# EAGLE design board (EAGLE 9.6.2)
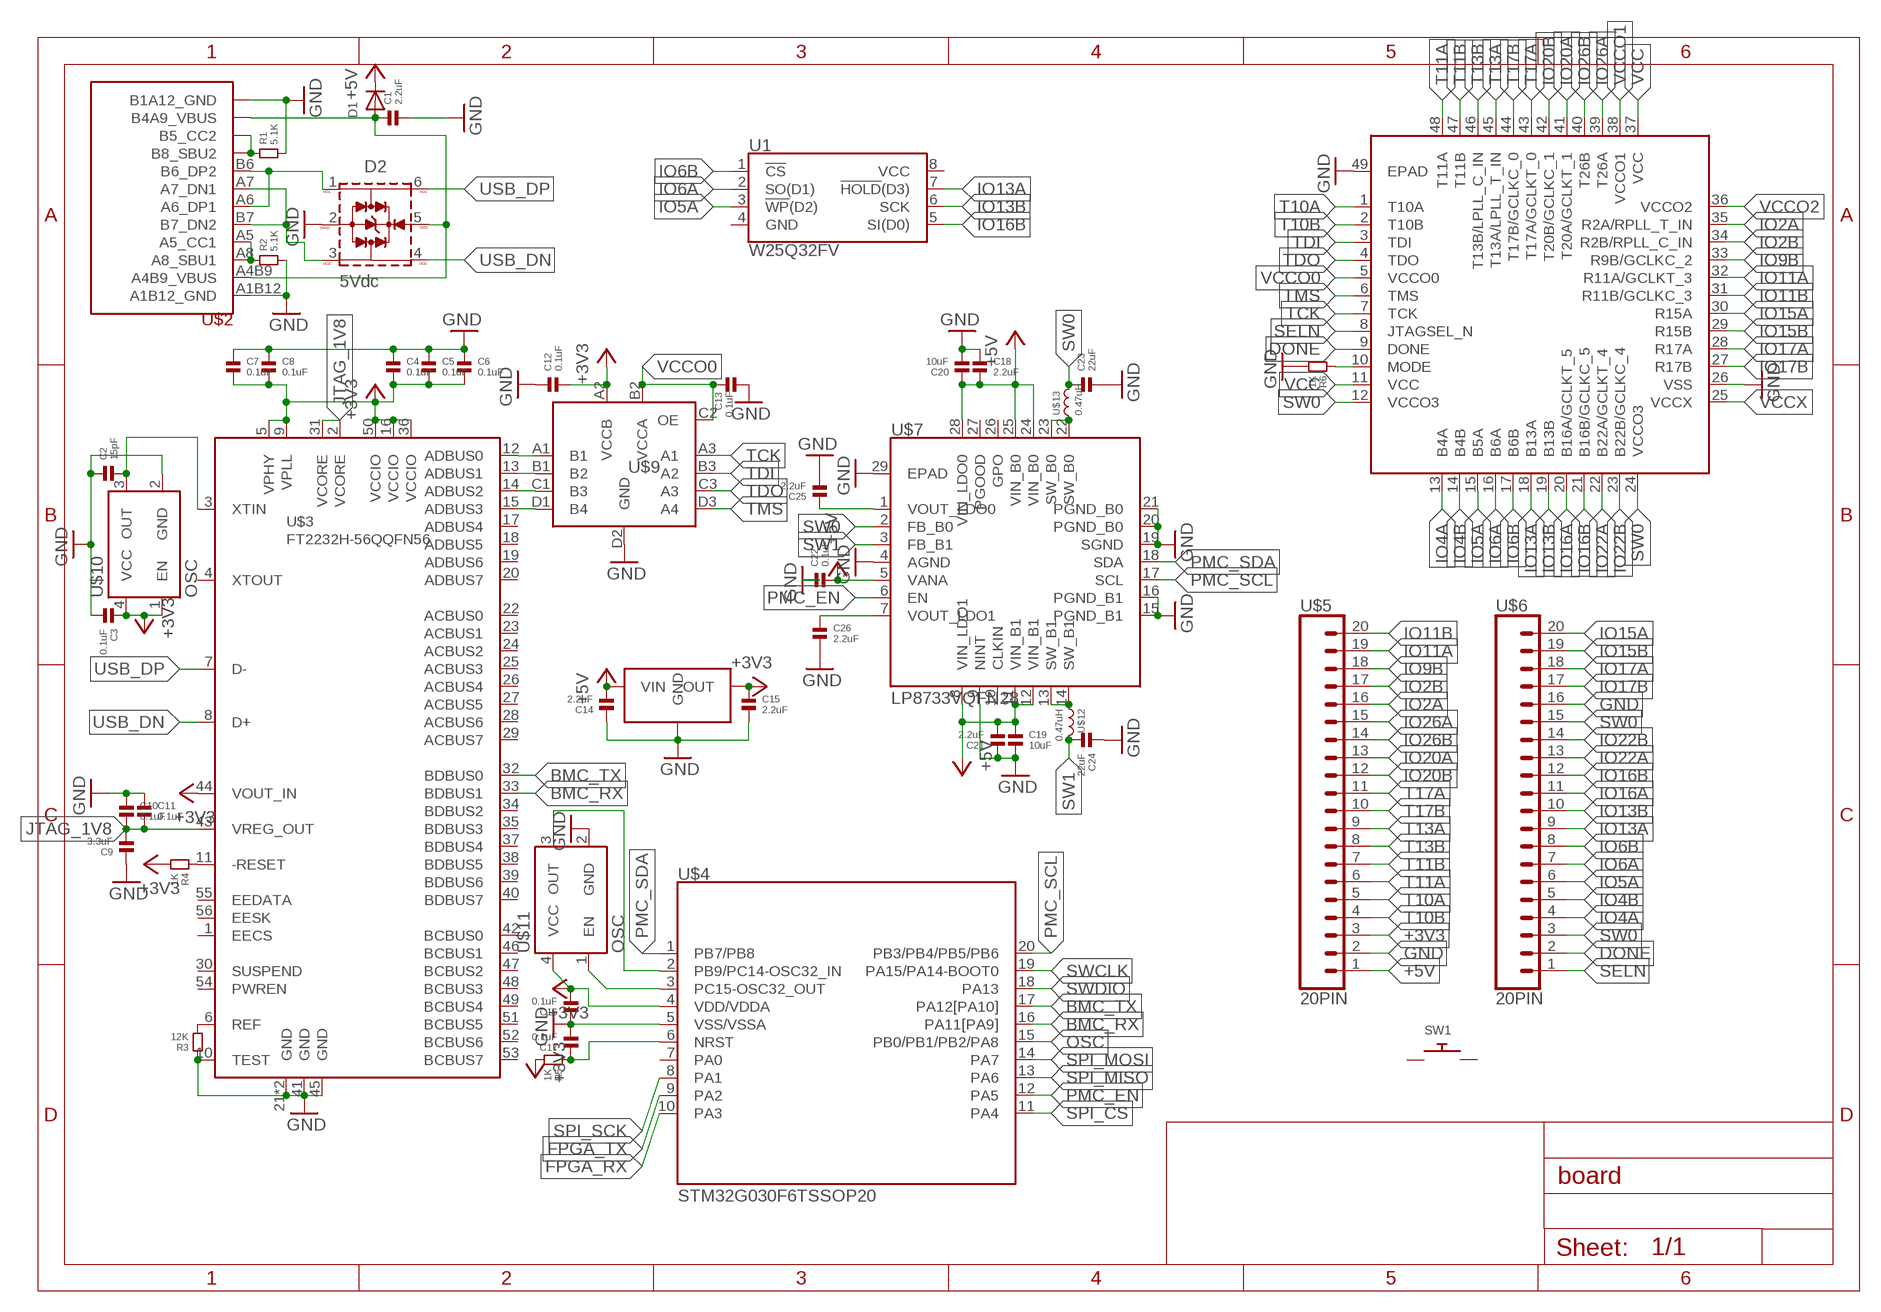
[diagram p0: schematic, sheet 1]

## Parts
C1  2.2uF  CAPACITOR0603  [0603_CAP]
C2  15pF  CAPACITOR  [0402_CAP]
C3  0.1uF  CAPACITOR  [0402_CAP]
C4  0.1uF  CAPACITOR  [0402_CAP]
C5  0.1uF  CAPACITOR  [0402_CAP]
C6  0.1uF  CAPACITOR  [0402_CAP]
C7  0.1uF  CAPACITOR  [0402_CAP]
C8  0.1uF  CAPACITOR  [0402_CAP]
C9  3.3uF  CAPACITOR0603  [0603_CAP]
C10  0.1uF  CAPACITOR  [0402_CAP]
C11  0.1uF  CAPACITOR  [0402_CAP]
C12  0.1uF  CAPACITOR  [0402_CAP]
C13  0.1uF  CAPACITOR  [0402_CAP]
C14  2.2uF  CAPACITOR0603  [0603_CAP]
C15  2.2uF  CAPACITOR0603  [0603_CAP]
C16  0.1uF  CAPACITOR  [0402_CAP]
C17  0.1uF  CAPACITOR  [0402_CAP]
C18  2.2uF  CAPACITOR0603  [0603_CAP]
C19  10uF  CAPACITOR0805  [0805_CAP]
C20  10uF  CAPACITOR0805  [0805_CAP]
C21  2.2uF  CAPACITOR0603  [0603_CAP]
C22  0.1uF  CAPACITOR  [0402_CAP]
C23  22uF  CAPACITOR0805  [0805_CAP]
C24  22uF  CAPACITOR0805  [0805_CAP]
C25  2.2uF  CAPACITOR0603  [0603_CAP]
C26  2.2uF  CAPACITOR0603  [0603_CAP]
D1  DIODESOD-323F  [SOD-323F]
D2  5Vdc  WE-TVS-HS_SOT23-6L_82400102  [WE-TVS_SOT23-6L]
R1  5.1K  RESISTOR.0402  [0402]
R2  5.1K  RESISTOR.0402  [0402]
R3  12K  RESISTOR.0402  [0402]
R4  1K  RESISTOR.0402  [0402]
R5  1K  RESISTOR.0402  [0402]
R6  1K  RESISTOR.0402  [0402]
SW1  SWITCH_PUSHBUTTONC&K_KSS  [BTN_CK_KSS]
U1  W25Q32FV  GD25LQ128DVIG  [SOIC-8]
U$1  GW1NSR-4CQN48P  [QFN40P600X600X80-49T420N]
U$2  TYPEC  [TYPE-C-31-M-12]
U$3  FT2232H-56QQFN56  [QFN50P800X800X90-57T595N]
U$4  STM32G030F6TSSOP20  [SOP65P640X120-20N]
U$5  20PIN  120PIN  [HDRV20W64P254_1X20_5080X254X838B]
U$6  20PIN  120PIN  [HDRV20W64P254_1X20_5080X254X838B]
U$7  LP8733VQFN28  [QFN50P500X500X100-29T340N]
U$8  XC6206  [SOT95P280X125-3]
U$9  TXS0104EYZTR  [BGA12C50P3X4_186X136X62N]
U$10  OSC  [OSCCC200X160X85N]
U$11  OSC  [OSCCC200X160X85N]
U$12  0.47uH  SPH252012H1R5MT  [INDM2621X120]
U$13  0.47uH  SPH252012H1R5MT  [INDM2621X120]

## Nets
+3V3: C3.1 C4.2 C5.2 C6.2 C7.2 C8.2 C12.2 C15.1 C16.2 R4.2 R5.2 U$3.5(VPHY) U$3.9(VPLL) U$3.16(VCCIO) U$3.36(VCCIO) U$3.44(VOUT_IN) U$3.50(VCCIO) U$4.4(VDD/VDDA) U$5.3 U$8.2(OUT) U$9.A2(VCCB) U$10.1(EN) U$10.4(VCC) U$11.4(VCC)
+5V: C14.2 C18.2 C19.1 C20.1 C21.2 C22.2 D1.C U$5.1 U$7.5(VANA) U$7.8(VIN_LDO1) U$7.11(VIN_B1) U$7.12(VIN_B1) U$7.24(VIN_B0) U$7.25(VIN_B0) U$7.28(VIN_LDO0) U$8.3(VIN)
BMC_RX: U$3.33(BDBUS1) U$4.16(PA11[PA9])
BMC_TX: U$3.32(BDBUS0) U$4.17(PA12[PA10])
DONE: U$1.9(DONE) U$6.2
FB0: U$7.22(SW_B0) U$7.23(SW_B0) U$13.1
FB1: U$7.13(SW_B1) U$7.14(SW_B1) U$12.1
FPGA_RX: U$4.10(PA3)
FPGA_TX: U$4.9(PA2)
GND: C1.2 C2.1 C3.2 C4.1 C5.1 C6.1 C7.1 C8.1 C9.1 C10.1 C11.1 C12.1 C13.2 C14.1 C15.2 C16.1 C17.2 C18.1 C19.2 C20.2 C21.1 C22.1 C23.2 C24.1 C25.2 C26.2 D2.2(GND) R1.2 R2.2 R3.1 R6.2 U$1.26(VSS) U$1.49(EPAD) U$2.A1B12(A1B12_GND) U$2.B1A12(B1A12_GND) U$3.10(TEST) U$3.21(GND) U$3.41(GND) U$3.45(GND) U$3.57(GND) U$4.5(VSS/VSSA) U$5.2 U$6.16 U$7.4(AGND) U$7.9(NINT) U$7.15(PGND_B1) U$7.16(PGND_B1) U$7.19(SGND) U$7.20(PGND_B0) U$7.21(PGND_B0) U$7.29(EPAD) U$8.1(GND) U$9.D2(GND) U$10.2(GND) U$11.2(GND)
IO2A: U$1.35(R2A/RPLL_T_IN) U$5.16
IO2B: U$1.34(R2B/RPLL_C_IN) U$5.17
IO4A: U$1.13(B4A) U$6.4
IO4B: U$1.14(B4B) U$6.5
IO5A: U1.3(!WP!(D2)) U$1.15(B5A) U$6.6
IO6A: U1.2(SO(D1)) U$1.16(B6A) U$6.7
IO6B: U1.1(!CS!) U$1.17(B6B) U$6.8
IO9B: U$1.33(R9B/GCLKC_2) U$5.18
IO11A: U$1.32(R11A/GCLKT_3) U$5.19
IO11B: U$1.31(R11B/GCLKC_3) U$5.20
IO13A: U1.7(!HOLD!(D3)) U$1.18(B13A) U$6.9
IO13B: U1.6(SCK) U$1.19(B13B) U$6.10
IO15A: U$1.30(R15A) U$6.20
IO15B: U$1.29(R15B) U$6.19
IO16A: U$1.20(B16A/GCLKT_5) U$6.11
IO16B: U1.5(SI(D0)) U$1.21(B16B/GCLKC_5) U$6.12
IO17A: U$1.28(R17A) U$6.18
IO17B: U$1.27(R17B) U$6.17
IO20A: U$1.41(T20A/GCLKT_1) U$5.13
IO20B: U$1.42(T20B/GCLKC_1) U$5.12
IO22A: U$1.22(B22A/GCLKT_4) U$6.13
IO22B: U$1.23(B22B/GCLKC_4) U$6.14
IO26A: U$1.39(T26A) U$5.15
IO26B: U$1.40(T26B) U$5.14
JTAG_1V8: C9.2 C10.2 C11.2 U$3.2(VCORE) U$3.31(VCORE) U$3.43(VREG_OUT)
N$1: C2.2 U$3.3(XTIN) U$10.3(OUT)
N$2: U$3.12(ADBUS0) U$9.A1(B1)
N$3: U$3.13(ADBUS1) U$9.B1(B2)
N$4: U$3.14(ADBUS2) U$9.C1(B3)
N$5: U$3.15(ADBUS3) U$9.D1(B4)
N$6: D2.1(I/O1) U$2.A6(A6_DP1) U$2.B6(B6_DP2)
N$7: D2.3(I/O2) U$2.A7(A7_DN1) U$2.B7(B7_DN2)
N$8: C1.1 D1.A D2.5(VDD) U$2.A4B9(A4B9_VBUS) U$2.B4A9(B4A9_VBUS)
N$9: R2.1 U$2.A5(A5_CC1) U$2.A8(A8_SBU1)
N$10: R1.1 U$2.B5(B5_CC2) U$2.B8(B8_SBU2)
N$12: R3.2 U$3.6(REF)
N$13: R4.1 U$3.11(-RESET)
N$15: C17.1 R5.1 U$4.6(NRST)
N$17: R6.1 U$1.10(MODE)
N$56: C25.1 U$7.1(VOUT_LDO0)
N$60: U$4.2(PB9/PC14-OSC32_IN) U$11.3(OUT)
N$61: U$4.3(PC15-OSC32_OUT) U$11.1(EN)
N$62: C26.1 U$7.7(VOUT_LDO1)
OSC: U$4.15(PB0/PB1/PB2/PA8)
PMC_EN: U$4.12(PA5) U$7.6(EN)
PMC_SCL: U$4.20(PB3/PB4/PB5/PB6) U$7.17(SCL)
PMC_SDA: U$4.1(PB7/PB8) U$7.18(SDA)
SELN: U$1.8(JTAGSEL_N) U$6.1
SPI_CS: U$4.11(PA4)
SPI_MISO: U$4.13(PA6)
SPI_MOSI: U$4.14(PA7)
SPI_SCK: U$4.8(PA1)
SW0: C23.1 U$1.12(VCCO3) U$1.24(VCCO3) U$6.3 U$6.15 U$7.2(FB_B0) U$13.2
SW1: C24.2 U$7.3(FB_B1) U$12.2
SWCLK: U$4.19(PA15/PA14-BOOT0)
SWDIO: U$4.18(PA13)
T10A: U$1.1(T10A) U$5.5
T10B: U$1.2(T10B) U$5.4
T11A: U$1.48(T11A) U$5.6
T11B: U$1.47(T11B) U$5.7
T13A: U$1.45(T13A/LPLL_T_IN) U$5.9
T13B: U$1.46(T13B/LPLL_C_IN) U$5.8
T17A: U$1.43(T17A/GCLKT_0) U$5.11
T17B: U$1.44(T17B/GCLKC_0) U$5.10
TCK: U$1.7(TCK) U$9.A3(A1)
TDI: U$1.3(TDI) U$9.B3(A2)
TDO: U$1.4(TDO) U$9.C3(A3)
TMS: U$1.6(TMS) U$9.D3(A4)
USB_DN: D2.4(I/O4) U$3.8(D+)
USB_DP: D2.6(I/O3) U$3.7(D-)
VCC: U$1.11(VCC) U$1.37(VCC)
VCCO0: C13.1 U$1.5(VCCO0) U$9.B2(VCCA) U$9.C2(OE)
VCCO1: U$1.38(VCCO1)
VCCO2: U$1.36(VCCO2)
VCCX: U$1.25(VCCX)
Unconnected: SW1.P$1 SW1.P$2 U1.4(GND) U1.8(VCC) U$3.1(EECS) U$3.4(XTOUT) U$3.17(ADBUS4) U$3.18(ADBUS5) U$3.19(ADBUS6) U$3.20(ADBUS7) U$3.22(ACBUS0) U$3.23(ACBUS1) U$3.24(ACBUS2) U$3.25(ACBUS3) U$3.26(ACBUS4) U$3.27(ACBUS5) U$3.28(ACBUS6) U$3.29(ACBUS7) U$3.30(SUSPEND) U$3.34(BDBUS2) U$3.35(BDBUS3) U$3.37(BDBUS4) U$3.38(BDBUS5) U$3.39(BDBUS6) U$3.40(BDBUS7) U$3.42(BCBUS0) U$3.46(BCBUS1) U$3.47(BCBUS2) U$3.48(BCBUS3) U$3.49(BCBUS4) U$3.51(BCBUS5) U$3.52(BCBUS6) U$3.53(BCBUS7) U$3.54(PWREN) U$3.55(EEDATA) U$3.56(EESK) U$4.7(PA0) U$7.10(CLKIN) U$7.26(GPO) U$7.27(PGOOD)

## Library data of the parts
C1-C26 = standardparts:CAPACITOR
D1 = adafruit:DIODE: Diode SMADIODE - SMA Surface Mount Package 20V 1A Schottky Diode Digikey: 641-1014-6-ND DO-1N4148 - Through Hole Small Current Diode SOD-123 20V 1 A (.5mV Vf) Schottky Diode - Digikey: MBRX120TPMSCT-ND SOD-323 10V 570mA (.38mV Vf, 3ns) Schottky Diode - Digikey: ZLLS410CT-ND SOD-523 30V 30mA Schottky Diode (RB751S-40TE61) - Digikey: RB751S-40TE61CT-ND SOT23-R/W - SOT23 Package (R = Solder Paste/Reflow Ovens, W = Hand-Soldering) BAT54Film 40V 300mA - Digikey: 497-7162-1-ND
D2 = Wurth_EMC Components_WE-TVS:WE-TVS-HS_SOT23-6L_82400102: WE-TVS TVS Diode – High Speed Series Characteristics Low clamping voltage Sturdy design Very low capacitance Flow Thru Design for a simple layout Rail to Rail protection Epoxy flame resistant UL94-V0 RoHS, REACH and free of halogens Applications Very fast data lines USB 2.0 Ethernet PoE VGA Sim Cards Keypads HS = High Speed <https://katalog.we-online.com/media/images/v2/o14883v209%20Family_WE-TVS_HIGHSPEED.> Details see: https://katalog.we-online.com/en/pbs/WE-TVS-HS Updated by Ella Wu 2019-07-12 2019 (C) Wurth Elektronik; C-CH: 2pF; CHANNELS: 2+1; DATASHEET-URL: https://www.we-online.com/catalog/datasheet/82400102.pdf; IPEAK: 6A; MOUNT: SMT; PART-NUMBER: 82400102; VBR: 6V
R1-R6 = standardparts:RESISTOR
SW1 = adafruit:SWITCH_PUSHBUTTON: Buttons SOFTTOUCHSMD_SJ - Soft touch temporary push button (Super Junk Akihabara) Compatible with SKPMANE010 [Mouser: 688-SKPMAN] C&K_KSS = Digikey: KSS221GLFS
U1 = Kendryte-K210:GD25LQ128D: W25Q32FV 32Mb (4MB) Serial Flash Memory The W25Q32FV support the standard Serial Peripheral Interface (SPI), Dual/Quad I/O SPI as well as 2-clocks instruction cycle Quad Peripheral Interface (QPI). 104MHz, SPI, 8-SOIC-EIAJ Datasheet <http://www.winbond.com/resource-files/w25q32fv%20revh%20091613.pdf> SparkFun Products SparkFun Blynk Board - ESP8266 <https://www.sparkfun.com/products/13794> (WRL-13794); PROD_ID: IC-13229
U$1 = Gowin:GW1NSR-4C
U$2 = Kendryte-K210:TYPEC
U$3 = Gowin:FT2232H-56Q
U$4 = Gowin:STM32G030F6
U$5 U$6 = Gowin:1*20PIN
U$7 = Gowin:LP8733
U$8 = AG1280:XC6206
U$9 = Gowin:TXS0104
U$10 U$11 = Gowin:OSC
U$12 U$13 = Kendryte-K210:SPH252012H1R5MT

## Board
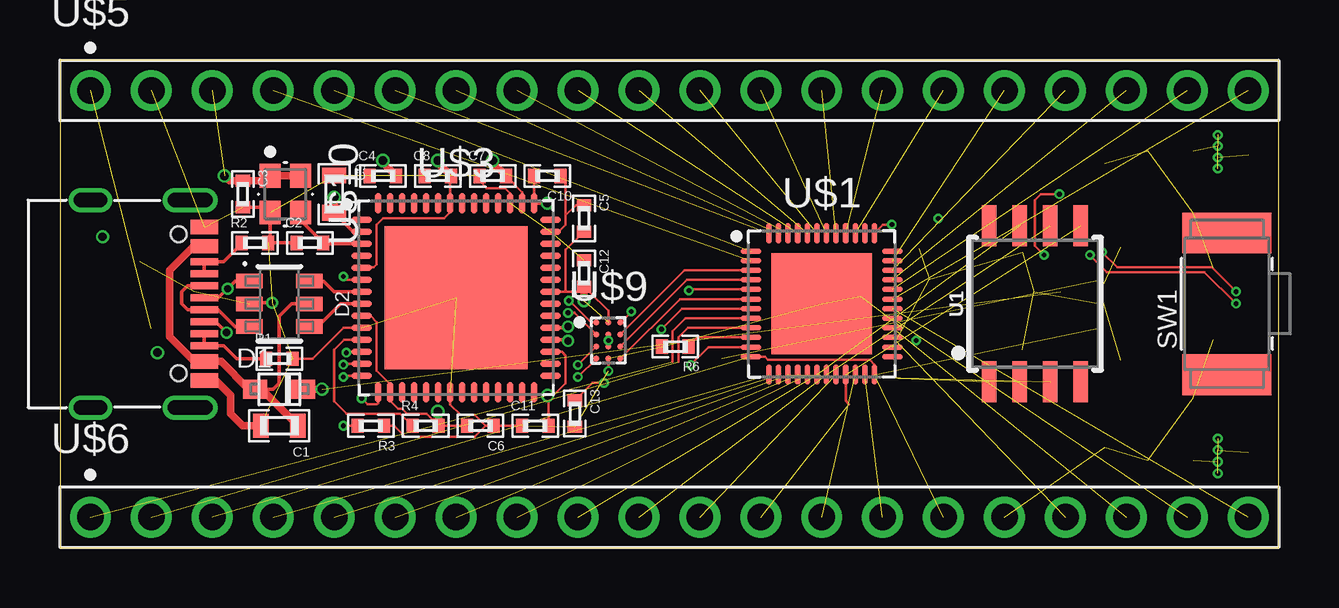
[diagram p1: board, top side]
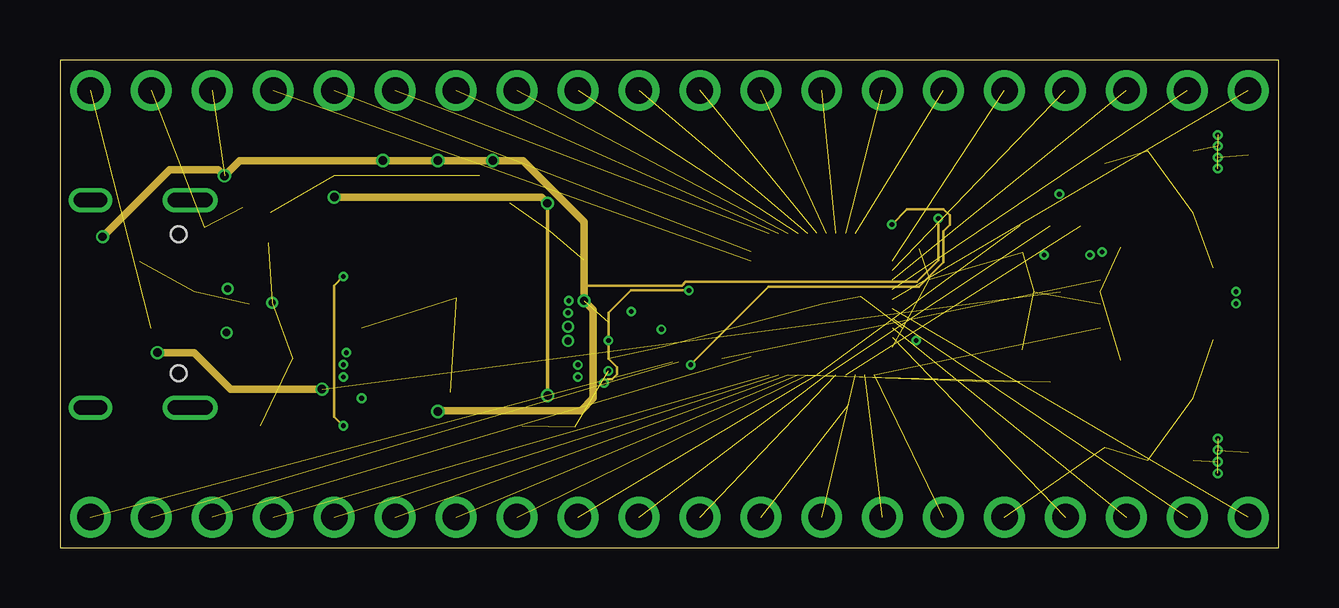
[diagram p2: board, inner layer POWER]
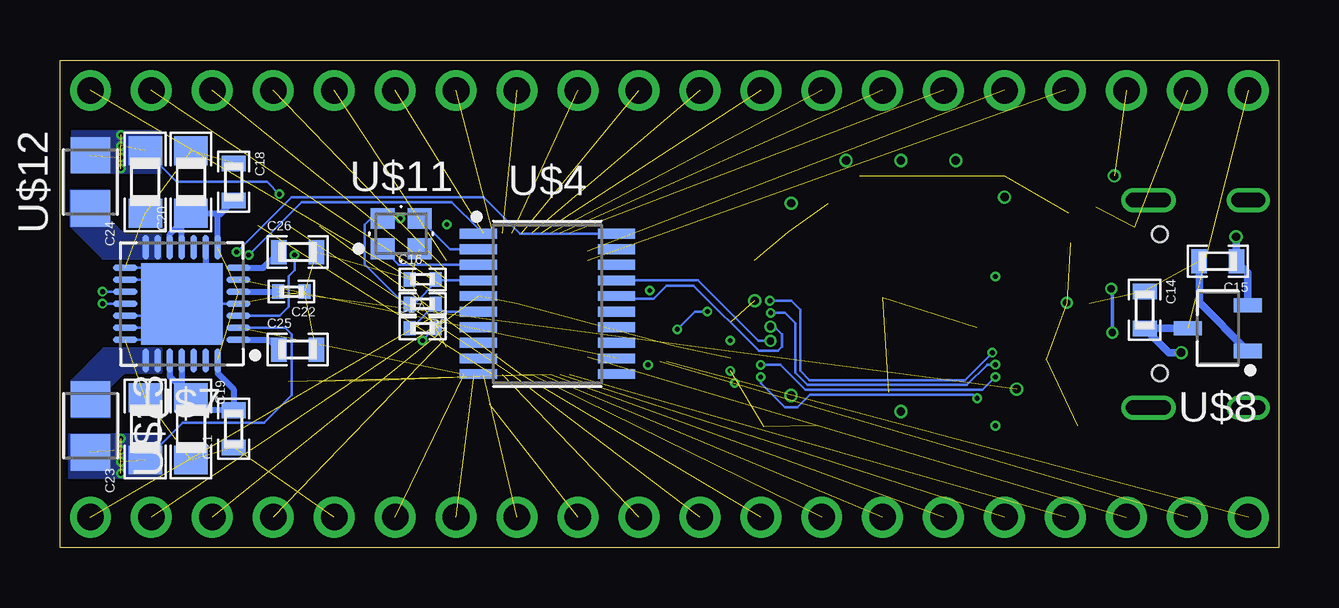
[diagram p3: board, bottom side, seen from below]

Size 50.8 x 20.32 mm. Coordinates in mm from the lower left corner, seen from the top.
Outline: 0,0 50.8,0 50.8,20.32 0,20.32 0,0
Copper layers (1+2*15+16): Top 0.035mm / dielectric 0.2mm / GND 0.0175mm / dielectric 1.065mm / POWER 0.0175mm / dielectric 0.2mm / Bottom 0.035mm
Design rules "default *": minimum track width 4mil, minimum drill 0.2mm, track to track 4mil, track to pad 4mil, pad to pad 4mil, via to via 4mil, smd to smd 4mil, copper to edge 12mil, drill to drill 6mil, minimum pad ring 0.1mm, minimum via ring 0.1mm, stop-mask expansion 4mil, vias tented up to drill 0.5mm, thermal gap 10mil

### Footprints (pad centres in the part's own frame; a part is rotated, then mirrored left to right if it is on the bottom)
0603_CAP = smd 0.65 x 1: 1 -0.775,0; 2 0.775,0
0402_CAP = smd 0.5 x 0.6: 1 -0.55,0; 2 0.55,0
0805_CAP = smd 1.2 x 1.4: 1 -1.3,0; 2 1.3,0
SOD-323F = smd 1 x 0.8: A -1,0; C 1,0
WE-TVS_SOT23-6L = smd 0.6 x 1.1: 1 -0.95,-1.25; 2 0,-1.25; 3 0.95,-1.25; 4 0.95,1.25; 5 0,1.25; 6 -0.95,1.25
0402 = smd 0.5 x 0.6: 1 -0.55,0; 2 0.55,0
BTN_CK_KSS = smd 1.7 x 3.7: P$1 -2.95,0; P$2 2.95,0
SOIC-8 = smd 0.61 x 1.702: 1 -1.905,-3.251; 2 -0.635,-3.251; 3 0.635,-3.251; 4 1.905,-3.251; 5 1.905,3.251; 6 0.635,3.251; 7 -0.635,3.251; 8 -1.905,3.251
QFN40P600X600X80-49T420N = smd 0.838 x 0.22: 1 -2.946,2.2; 2 -2.946,1.8; 3 -2.946,1.4; 4 -2.946,1; 5 -2.946,0.6; 6 -2.946,0.2; 7 -2.946,-0.2; 8 -2.946,-0.6; 9 -2.946,-1; 10 -2.946,-1.4; 11 -2.946,-1.8; 12 -2.946,-2.2; 25 2.946,-2.2; 26 2.946,-1.8; 27 2.946,-1.4; 28 2.946,-1; 29 2.946,-0.6; 30 2.946,-0.2; 31 2.946,0.2; 32 2.946,0.6; 33 2.946,1; 34 2.946,1.4; 35 2.946,1.8; 36 2.946,2.2 | smd 0.22 x 0.838: 13 -2.2,-2.946; 14 -1.8,-2.946; 15 -1.4,-2.946; 16 -1,-2.946; 17 -0.6,-2.946; 18 -0.2,-2.946; 19 0.2,-2.946; 20 0.6,-2.946; 21 1,-2.946; 22 1.4,-2.946; 23 1.8,-2.946; 24 2.2,-2.946; 37 2.2,2.946; 38 1.8,2.946; 39 1.4,2.946; 40 1,2.946; 41 0.6,2.946; 42 0.2,2.946; 43 -0.2,2.946; 44 -0.6,2.946; 45 -1,2.946; 46 -1.4,2.946; 47 -1.8,2.946; 48 -2.2,2.946 | smd 4.2 x 4.2: 49 0,0
TYPE-C-31-M-12 = smd 0.6 x 1.14: A1B12 -3.2,4.75; A4B9 -2.4,4.75; B1A12 3.2,4.75; B4A9 2.4,4.75 | smd 0.3 x 1.14: A5 -1.25,4.75; A6 -0.25,4.75; A7 0.25,4.75; A8 -1.75,4.75; B5 1.75,4.75; B6 0.75,4.75; B7 -0.75,4.75; B8 1.25,4.75 | drill 0.6 pad 1: P$13 -4.32,4.8; P$14 -4.32,4.64; P$15 -4.32,0.4; P$16 -4.32,0.24; P$17 -4.32,4.48; P$18 -4.32,4.32; P$19 -4.32,4.16; P$20 -4.32,4; P$21 -4.32,3.84; P$22 -4.32,3.68; P$23 -4.32,3.52; P$24 4.32,4.8; P$25 4.32,4.64; P$26 4.32,4.48; P$27 4.32,4.32; P$28 4.32,4.16; P$29 4.32,4; P$30 4.32,3.84; P$31 4.32,3.68; P$32 4.32,3.52; P$33 -4.32,0.08; P$34 -4.32,-0.08; P$35 -4.32,-0.24; P$36 -4.32,-0.4; P$37 4.32,0.4; P$38 4.32,0.24; P$39 4.32,0.08; P$40 4.32,-0.08; P$41 4.32,-0.24; P$42 4.32,-0.4 | hole 0.65: -2.89,3.68; 2.89,3.68
QFN50P800X800X90-57T595N = smd 0.86 x 0.27: 1 -3.935,3.25; 2 -3.935,2.75; 3 -3.935,2.25; 4 -3.935,1.75; 5 -3.935,1.25; 6 -3.935,0.75; 7 -3.935,0.25; 8 -3.935,-0.25; 9 -3.935,-0.75; 10 -3.935,-1.25; 11 -3.935,-1.75; 12 -3.935,-2.25; 13 -3.935,-2.75; 14 -3.935,-3.25; 29 3.935,-3.25; 30 3.935,-2.75; 31 3.935,-2.25; 32 3.935,-1.75; 33 3.935,-1.25; 34 3.935,-0.75; 35 3.935,-0.25; 36 3.935,0.25; 37 3.935,0.75; 38 3.935,1.25; 39 3.935,1.75; 40 3.935,2.25; 41 3.935,2.75; 42 3.935,3.25 | smd 0.27 x 0.86: 15 -3.25,-3.935; 16 -2.75,-3.935; 17 -2.25,-3.935; 18 -1.75,-3.935; 19 -1.25,-3.935; 20 -0.75,-3.935; 21 -0.25,-3.935; 22 0.25,-3.935; 23 0.75,-3.935; 24 1.25,-3.935; 25 1.75,-3.935; 26 2.25,-3.935; 27 2.75,-3.935; 28 3.25,-3.935; 43 3.25,3.935; 44 2.75,3.935; 45 2.25,3.935; 46 1.75,3.935; 47 1.25,3.935; 48 0.75,3.935; 49 0.25,3.935; 50 -0.25,3.935; 51 -0.75,3.935; 52 -1.25,3.935; 53 -1.75,3.935; 54 -2.25,3.935; 55 -2.75,3.935; 56 -3.25,3.935 | smd 5.95 x 5.95: 57 0,0
SOP65P640X120-20N = smd 1.559 x 0.407: 1 -2.878,2.925; 2 -2.878,2.275; 3 -2.878,1.625; 4 -2.878,0.975; 5 -2.878,0.325; 6 -2.878,-0.325; 7 -2.878,-0.975; 8 -2.878,-1.625; 9 -2.878,-2.275; 10 -2.878,-2.925; 11 2.878,-2.925; 12 2.878,-2.275; 13 2.878,-1.625; 14 2.878,-0.975; 15 2.878,-0.325; 16 2.878,0.325; 17 2.878,0.975; 18 2.878,1.625; 19 2.878,2.275; 20 2.878,2.925
HDRV20W64P254_1X20_5080X254X838B = drill 1.105 pad 1.705: 1 0,0; 2 2.54,0; 3 5.08,0; 4 7.62,0; 5 10.16,0; 6 12.7,0; 7 15.24,0; 8 17.78,0; 9 20.32,0; 10 22.86,0; 11 25.4,0; 12 27.94,0; 13 30.48,0; 14 33.02,0; 15 35.56,0; 16 38.1,0; 17 40.64,0; 18 43.18,0; 19 45.72,0; 20 48.26,0
QFN50P500X500X100-29T340N = smd 1.01 x 0.27: 1 -2.36,1.5; 2 -2.36,1; 3 -2.36,0.5; 4 -2.36,0; 5 -2.36,-0.5; 6 -2.36,-1; 7 -2.36,-1.5; 15 2.36,-1.5; 16 2.36,-1; 17 2.36,-0.5; 18 2.36,0; 19 2.36,0.5; 20 2.36,1; 21 2.36,1.5 | smd 0.27 x 1.01: 8 -1.5,-2.36; 9 -1,-2.36; 10 -0.5,-2.36; 11 0,-2.36; 12 0.5,-2.36; 13 1,-2.36; 14 1.5,-2.36; 22 1.5,2.36; 23 1,2.36; 24 0.5,2.36; 25 0,2.36; 26 -0.5,2.36; 27 -1,2.36; 28 -1.5,2.36 | smd 3.4 x 3.4: 29 0,0
SOT95P280X125-3 = smd 1.171 x 0.589: 1 -1.25,0.95; 2 -1.25,-0.95; 3 1.25,0
BGA12C50P3X4_186X136X62N = smd 0.25 x 0.25: A1 -0.5,0.75; A2 0,0.75; A3 0.5,0.75; B1 -0.5,0.25; B2 0,0.25; B3 0.5,0.25; C1 -0.5,-0.25; C2 0,-0.25; C3 0.5,-0.25; D1 -0.5,-0.75; D2 0,-0.75; D3 0.5,-0.75
OSCCC200X160X85N = smd 0.998 x 0.868: 1 -0.767,-0.632; 2 0.767,-0.632; 3 0.767,0.632; 4 -0.767,0.632
INDM2621X120 = smd 1.51 x 1.629: 1 -1.11,0; 2 1.11,0

### Placement (x,y rotation side)
C1  9.14,5.08 180 top
C2  10.41,12.7 0 top
C3  7.62,14.73 270 top
C4  13.46,15.49 0 top
C5  21.84,13.72 270 top
C6  17.53,5.08 180 top
C7  18.03,15.49 0 top
C8  15.75,15.49 0 top
C9  11.43,14.73 270 top
C10  20.32,15.49 180 top
C11  19.81,5.08 0 top
C12  21.84,11.43 270 top
C13  21.46,5.59 270 top
C14  5.59,9.91 270 bottom
C15  2.54,11.94 180 bottom
C16  35.69,11.18 0 bottom
C17  35.69,9.14 0 bottom
C18  43.56,15.24 270 bottom
C19  45.34,4.95 270 bottom
C20  45.34,15.24 90 bottom
C21  43.56,4.95 90 bottom
C22  41.15,10.67 180 bottom
C23  47.24,4.95 90 bottom
C24  47.24,15.24 90 bottom
C25  40.89,8.26 0 bottom
C26  40.89,12.32 0 bottom
D1  9.14,6.6 0 top
D2  9.14,10.16 270 top
R1  9.14,7.87 0 top
R2  8.13,12.7 0 top
R3  12.95,5.08 180 top
R4  15.24,5.08 0 top
R5  35.69,10.16 180 bottom
R6  25.65,8.38 180 top
SW1  48.64,10.16 90 top
U1  40.64,10.16 0 top
U$1  31.75,10.16 0 top
U$2  1.27,10.16 270 top
U$3  16.51,10.41 0 top
U$4  30.48,10.16 0 bottom
U$5  1.27,19.05 0 top
U$6  1.27,1.27 0 top
U$7  45.72,10.16 180 bottom
U$8  2.54,9.14 180 bottom
U$9  22.86,8.64 0 top
U$10  9.4,14.73 270 top
U$11  36.58,13.08 0 bottom
U$12  49.53,15.24 90 bottom
U$13  49.53,5.08 270 bottom

### Tracks (layer width: path | path; a pad name or v marks a point on that pad's centre or on a via)
+3V3  (via drill 0.2, 0.35)  (2 unrouted)
  Top 0.102: U$3.36 21.08,10.66 | 21.08,10.66 22.06,10.66 22.86,9.86 U$9.A2 | 12.55,11.68 U$3.5 12.6,11.68 13.08,11.68 13.21,11.81 13.21,13.46 13.46,13.72 16,13.72 16.26,13.97 U$3.50 16.26,15.46 C8.2 | C7.2 19.26,14.82 U$3.44 | U$3.9 12.94,9.66 13.21,9.4 13.21,7.37 13.76,6.81 U$3.16 13.76,6.13 14.1,5.79 14.27,5.79 14.47,5.59 15.28,5.59 R4.2 C6.2 | C5.2 21.08,12.4 21.08,10.66
  Top 0.152: 8.7,15.43 U$10.1
  Top 0.305: v6.86,15.49 7.07,15.28 C3.1 8.55,15.28 8.7,15.43 | U$10.1 U$10.4 | R4.2 15.79,5.63 v15.75,5.67 | C12.2 v21.84,10.29 | C7.2 18.03,16.04 v18.03,16.13 | C8.2 15.75,16.04 v15.75,16.13 | C4.2 13.46,16.04 v13.46,16.13
  POWER 0.102: v36.61,13.72 36.61,11.97 35.71,11.07 26.07,11.07 25.92,10.92 21.84,10.92
  POWER 0.305: v1.78,12.95 4.57,15.75 6.6,15.75 v6.86,15.49 7.49,16.13 v13.46,16.13 v15.75,16.13 v18.03,16.13 19.3,16.13 21.84,13.59 21.84,10.92 v21.84,10.29 22.23,9.91 22.23,6.22 21.72,5.71 15.75,5.71 v15.75,5.67
  Bottom 0.102: U$4.4 35.05,11.13 | 35.05,11.13 35.1,11.13 C16.2 | 35.05,11.13 36.03,10.16 R5.2 36.32,10.24 36.53,10.24 38.1,11.81 38.1,13.46 37.85,13.71 U$11.4 v36.61,13.71 v36.61,13.72
  Bottom 0.305: U$8.2 1.29,11.46 C15.1 v1.78,12.95
+5V  (via drill 0.35)  (4 unrouted)
  Top 0.305: D1.C v10.92,6.6
  POWER 0.305: v10.92,6.6 7.11,6.6 5.59,8.13 v4.06,8.13
  Bottom 0.102: 41.78,10.66 C22.2
  Bottom 0.254: U$7.28 44.22,7.26 43.56,6.6 C21.2 44.81,5.73 C19.1 45.72,6.63 | U$7.25 45.72,6.63 | U$7.24 46.22,7.13 45.72,6.63 | U$7.12 46.22,13.06 45.72,13.56 | U$7.11 45.72,13.56 | 45.72,13.56 C20.1 44.09,13.94 | U$7.8 44.22,13.81 44.09,13.94 | 44.09,13.94 C18.2 | U$7.5 41.78,10.66
  Bottom 0.305: v4.06,8.13 4.58,8.13 C14.2 5.58,9.14 U$8.3
BMC_RX  (via drill 0.3)
  Top 0.152: U$3.33 21.13,9.16 v21.18,9.21
  Bottom 0.102: v21.18,9.21 21.03,9.21 20.7,8.89 20.7,8.38 20.87,8.21 21.67,8.21 24.38,10.92 25.51,10.92 26.07,10.37 27.48,10.37 U$4.16
BMC_TX  (via drill 0.3)
  Top 0.152: U$3.32 21.13,8.66 v21.18,8.61
  Bottom 0.102: U$4.17 24.22,11.13 21.69,8.61 v21.18,8.61
DONE  (1 unrouted)
  Top 0.102: U$1.9 26.18,9.16 25.78,8.76 25.78,7.75
FB0
  pour Bottom (no thermals): 46.58,8.28 47.29,8.28 49,8.28 50.32,6.96 50.32,5.44 48.72,5.44 48.72,6.68 48.16,7.24 48.11,7.29 46.61,7.29 46.58,7.32
FB1
  pour Bottom (no thermals): 46.63,13.03 47.32,13.03 48.11,13.03 48.44,13.36 48.74,13.67 48.74,14.86 48.77,14.88 50.34,14.88 50.34,13.39 49.02,12.06 46.61,12.06 46.61,13.03
GND  (via drill 0.2, 0.3)  (35 unrouted)
  Top 0.102: U$3.45 18.76,14.77 18.54,14.99 17.78,14.99 17.48,15.28 C7.1 | U$3.10 11.83,9.16 10.54,7.87 R1.2 | U$3.21 16.26,5.96 16.69,5.53 17.29,5.53 17.74,5.08 | 17.74,5.08 C6.1 C11.1 | R3.1 13.92,5.08 14.38,4.63 17.29,4.63 17.74,5.08 | U$3.41 20.78,13.16 21.08,13.46 21.08,13.84 | 21.08,13.84 21.5,14.27 C5.1 | C10.1 21.08,15.28 21.08,13.84 | U$9.D2 v22.86,7.37
  Top 0.152: D2.2 7.94,10.21 v8.84,10.21 | C2.1 R2.2 8.77,12.79 U$10.2 8.55,14.18 C3.2
  Top 0.305: U$2.B1A12 6.5,6.96 7.11,6.35 7.11,5.59 7.62,5.08 C1.2
  Bottom 0.102: C17.2 35.18,9.14 v35.69,8.64 | U$7.4 45.47,10.16 | 45.47,10.16 U$7.29 | U$7.19 46.22,9.66 | 46.22,9.66 U$7.29 | U$7.20 46.47,9.16 45.47,10.16 | U$7.21 47.22,8.66 46.22,9.66 | U$7.16 46.72,11.16 | 46.72,11.16 U$7.29 | U$7.15 47.22,11.66 46.72,11.16
  Bottom 0.254: U$7.9 44.72,11.16 U$7.29
  Bottom 0.305: U$8.1 3.31,10.22 C15.2
IO2A  (1 unrouted)
IO2B  (1 unrouted)
IO4A  (1 unrouted)
IO4B  (1 unrouted)
IO5A  (2 unrouted)
IO6A  (2 unrouted)
IO6B  (2 unrouted)
IO9B  (1 unrouted)
IO11A  (1 unrouted)
IO11B  (1 unrouted)
IO13A  (2 unrouted)
IO13B  (2 unrouted)
IO15A  (1 unrouted)
IO15B  (1 unrouted)
IO16A  (1 unrouted)
IO16B  (2 unrouted)
  Top 0.102: U$1.21 32.75,6.11 32.89,5.97
IO17A  (1 unrouted)
IO17B  (1 unrouted)
IO20A  (1 unrouted)
IO20B  (1 unrouted)
IO22A  (1 unrouted)
IO22B  (1 unrouted)
IO26A  (1 unrouted)
IO26B  (1 unrouted)
JTAG_1V8  (via drill 0.35)
  Top 0.102: U$3.43 19.76,14.48 C10.2 | C11.2 20.36,6.14 20.45,6.22 | U$3.31 20.92,8.16 21.08,8 21.08,6.86 20.45,6.22 | v20.33,6.34 20.45,6.22
  Top 0.152: C9.2 12.22,13.16 U$3.2 | v20.32,14.35 19.89,14.35 19.76,14.48
  Top 0.305: C9.2 v11.43,14.61
  POWER 0.152: v20.32,14.35 v20.32,6.35 v20.33,6.34
  POWER 0.305: v11.43,14.61 20.07,14.61 v20.32,14.35
N$1
  Top 0.152: U$10.3 10.03,13.63 C2.2 11,12.66 U$3.3
N$2  (via drill 0.2)
  Top 0.102: v21.21,10.29 21.24,10.29 22.14,9.39 U$9.A1 | v11.94,8.13 11.97,8.16 U$3.12
  Bottom 0.102: v21.21,10.29 20.32,10.29 19.94,9.91 19.94,7.37 19.56,6.98 13.08,6.98 v11.94,8.13
N$3  (via drill 0.2)
  Top 0.102: U$3.13 11.85,7.66 v11.81,7.63 | U$9.B1 22.29,8.96 22.28,8.96 21.45,9.79 v21.18,9.79
  Bottom 0.102: v11.81,7.63 12.15,7.63 13,6.78 19.64,6.78 20.14,7.28 20.14,9.35 20.58,9.79 v21.18,9.79
N$4  (via drill 0.2)
  Top 0.102: U$9.C1 v21.59,7.62 | v11.81,7.11 11.86,7.16 U$3.14
  Bottom 0.102: v21.59,7.62 20.77,7.62 19.73,6.58 12.34,6.58 v11.81,7.11
N$5  (via drill 0.2)
  Top 0.102: U$3.15 13.26,6.02 13.21,5.97 12.83,5.97 v12.57,6.23 | U$9.D1 v21.59,7.11
  Bottom 0.102: v12.57,6.23 v12.58,6.23 12.72,6.38 19.53,6.38 20.07,5.84 20.57,5.84 21.59,6.86 v21.59,7.11
N$6  (via drill 0.3)
  Top 0.152: D2.1 7.3,11.11 v6.99,10.79 6.6,10.41 U$2.A6 | U$2.B6 6.5,9.41 v6.94,8.96
  Bottom 0.152: v6.94,8.96 6.94,10.75 v6.99,10.79
N$7
  Top 0.152: D2.3 7.3,9.21 6.6,9.91 U$2.A7 5.33,9.91 5.08,10.16 5.08,10.67 5.32,10.91 U$2.B7
N$8
  Top 0.152: D2.5 9.65,10.16 9.14,9.65 9.14,6.86 8.89,6.6 D1.A
  Top 0.305: U$2.A4B9 5.57,12.56 4.57,11.57 4.57,8.78 5.59,7.76 U$2.B4A9 6.72,7.76 7.87,6.6 D1.A 8.4,6.6 C1.1
N$9
  Top 0.152: U$2.A5 U$2.A8 6.83,11.91 7.58,12.66 R2.1
N$10
  Top 0.152: U$2.B8 U$2.B5 6.83,8.41 7.37,7.87 R1.1
N$12  (via drill 0.2)
  Top 0.102: U$3.6 11.95,11.16 v11.81,11.3 | v11.81,5.08 R3.2
  POWER 0.102: v11.81,11.3 11.43,10.92 11.43,5.46 v11.81,5.08
N$13
  Top 0.102: R4.1 14.18,5.59 11.94,5.59 11.43,6.1 11.43,8.26 11.84,8.66 U$3.11
N$15
  Bottom 0.102: U$4.6 34.81,9.83 R5.1 36.15,9.14 C17.1
N$17
  Top 0.102: U$1.10 26.58,8.76 R6.1
N$56
  Bottom 0.254: U$7.1 42.07,8.66 C25.1
N$60
  Bottom 0.102: U$4.2 34.53,12.43 U$11.3
N$61
  Bottom 0.102: U$4.3 36.68,11.79 U$11.1
N$62
  Bottom 0.254: U$7.7 42.33,11.66 C26.1
PMC_EN  (1 unrouted)
PMC_SCL  (via drill 0.2)
  Top 0.102: v43.43,12.32 44.07,11.68 48.01,11.68 v49.02,10.67
  Bottom 0.102: U$4.20 31.63,13.08 33.15,14.61 41.15,14.61 v43.43,12.32 | v49.02,10.67 v49.01,10.66 U$7.17
PMC_SDA  (via drill 0.2)
  Top 0.102: v49.02,10.17 47.71,11.48 43.64,11.48 v42.93,12.19
  Bottom 0.102: U$7.18 v49.02,10.17 | v42.93,12.19 40.72,14.4 34.47,14.4 33.36,13.29 U$4.1
SELN  (1 unrouted)
  Top 0.102: U$1.8 26.07,9.56 25.53,9.02 25.53,7.75
SW0  (via drill 0.2)  (8 unrouted)
  Top 0.102: U$1.12 29.38,7.96 29.52,7.82 33.76,7.82 33.95,7.63 U$1.24
  Bottom 0.102: U$7.2 41.42,9.16 41.15,8.89 41.15,6.35 42.29,5.21 45.69,5.21 C23.1
  other vias: 48.26,3.58 48.26,4.06 48.26,4.55 48.26,3.1
  pour Bottom (no thermals): 50.42,4.7 50.42,2.92 46.61,2.92 46.61,4.7
SW1  (via drill 0.2)  (5 unrouted)
  Top 0.102: v41.02,12.19 40.64,12.57 40.64,14.48 40.89,14.73 v41.66,14.73
  Bottom 0.102: U$7.3 41.65,9.66 41.27,10.03 41.27,11.3 41.02,11.56 v41.02,12.19 | v41.66,14.73 42.16,15.24 45.94,15.24 C24.2
  other vias: 48.26,15.8 48.26,16.26 48.26,16.74 48.26,17.2
  pour Bottom (no thermals): 50.29,15.62 46.61,15.62 46.61,17.35 50.29,17.35
T10A  (1 unrouted)
T10B  (1 unrouted)
T11A  (1 unrouted)
T11B  (1 unrouted)
T13A  (1 unrouted)
T13B  (1 unrouted)
T17A  (1 unrouted)
T17B  (1 unrouted)
TCK  (via drill 0.2)
  Top 0.102: U$9.A3 v23.81,9.84 v23.82,9.84 | v25.07,9.1 25.93,9.96 U$1.7
  Bottom 0.102: v23.82,9.84 24.32,9.84 v25.07,9.1
TDI
  Top 0.102: U$9.B3 26.03,11.56 U$1.3
TDO
  Top 0.102: U$1.4 26.13,11.16 U$9.C3
TMS
  Top 0.102: U$9.D3 25.83,10.36 U$1.6
USB_DN
  Top 0.152: U$3.8 11.69,10.16 10.73,9.21 D2.4
USB_DP
  Top 0.152: U$3.7 11.43,10.67 10.99,11.11 D2.6
VCC  (via drill 0.2)
  Top 0.102: U$1.11 27.03,8.36 v26.29,7.62 | U$1.37 34.31,13.46 v34.67,13.46
  POWER 0.102: v26.29,7.62 29.54,10.87 35.79,10.87 36.81,11.89 36.81,13.19 37.08,13.46 37.08,13.84 36.83,14.1 35.31,14.1 v34.67,13.46
VCCO0  (via drill 0.2)
  Top 0.102: U$9.C2 v22.86,8.64 U$9.B2 | U$1.5 26.21,10.76 v26.21,10.72 | C13.1 22.19,6.86 v22.68,6.86
  POWER 0.102: v26.21,10.72 23.8,10.72 22.86,9.78 v22.86,8.64 22.86,7.86 23.21,7.51 23.21,7.22 23.01,7.01 22.83,7.01 v22.68,6.86